# EAGLE design Standalone Kaleidoscope 8085 LED BOARD V1 (EAGLE 9.0.0)
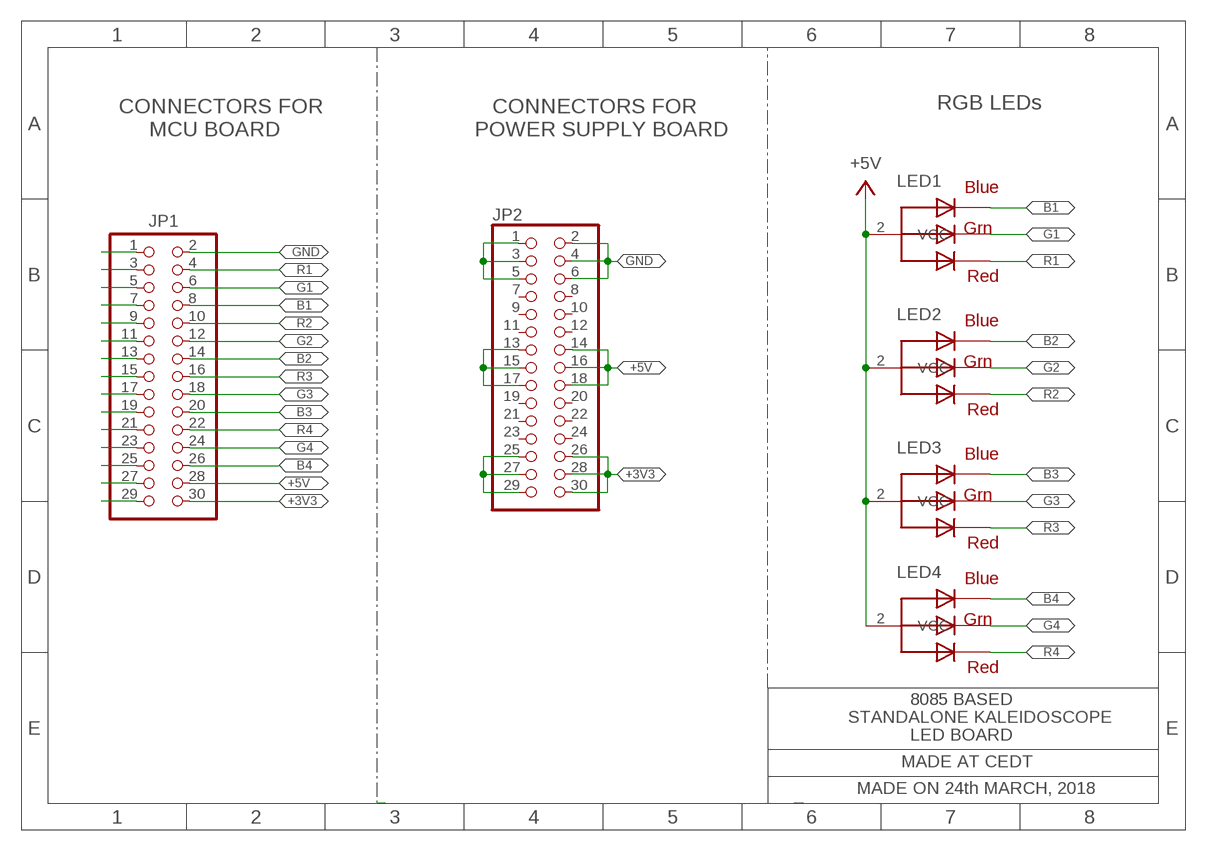
[diagram p0: schematic, sheet 1]

## Parts
JP1  PINHD-2X15  [2X15]
JP2  PINHD-2X15  [2X15]
LED1  RGBLED_CA  [LED5MMRGB]
LED2  RGBLED_CA  [LED5MMRGB]
LED3  RGBLED_CA  [LED5MMRGB]
LED4  RGBLED_CA  [LED5MMRGB]

## Nets
+3V3: JP1.29 JP1.30 JP2.25 JP2.26 JP2.27 JP2.28 JP2.29 JP2.30
+5V: JP1.27 JP1.28 JP2.13 JP2.14 JP2.15 JP2.16 JP2.17 JP2.18 LED1.2(VCC) LED2.2(VCC) LED3.2(VCC) LED4.2(VCC)
B1: JP1.7 JP1.8 LED1.4(BLUE)
B2: JP1.13 JP1.14 LED2.4(BLUE)
B3: JP1.19 JP1.20 LED3.4(BLUE)
B4: JP1.25 JP1.26 LED4.4(BLUE)
G1: JP1.5 JP1.6 LED1.3(GREEN)
G2: JP1.11 JP1.12 LED2.3(GREEN)
G3: JP1.17 JP1.18 LED3.3(GREEN)
G4: JP1.23 JP1.24 LED4.3(GREEN)
GND: JP1.1 JP1.2 JP2.1 JP2.2 JP2.3 JP2.4 JP2.5 JP2.6
R1: JP1.3 JP1.4 LED1.1(RED)
R2: JP1.9 JP1.10 LED2.1(RED)
R3: JP1.15 JP1.16 LED3.1(RED)
R4: JP1.21 JP1.22 LED4.1(RED)
Unconnected: JP2.7 JP2.8 JP2.9 JP2.10 JP2.11 JP2.12 JP2.19 JP2.20 JP2.21 JP2.22 JP2.23 JP2.24

## Notes on the sheet
- RGB LEDs
- CONNECTORS FOR
       MCU BOARD
- CONNECTORS FOR 
  POWER SUPPLY BOARD
- 8085 BASED
- STANDALONE KALEIDOSCOPE
- LED BOARD
- MADE AT CEDT
- MADE ON 24th MARCH, 2018

## Library data of the parts
JP1 JP2 = pinhead:PINHD-2X15: PIN HEADER
LED1-LED4 = 01_adafruit:RGBLED_CA: RGB LED, common-anode Staggered pins http://www.ladyada.net/library/pcb/eaglelibrary.html

## Net classes
1 VCC: width 0.61 mm
2 GND: width 0.61 mm

## Board
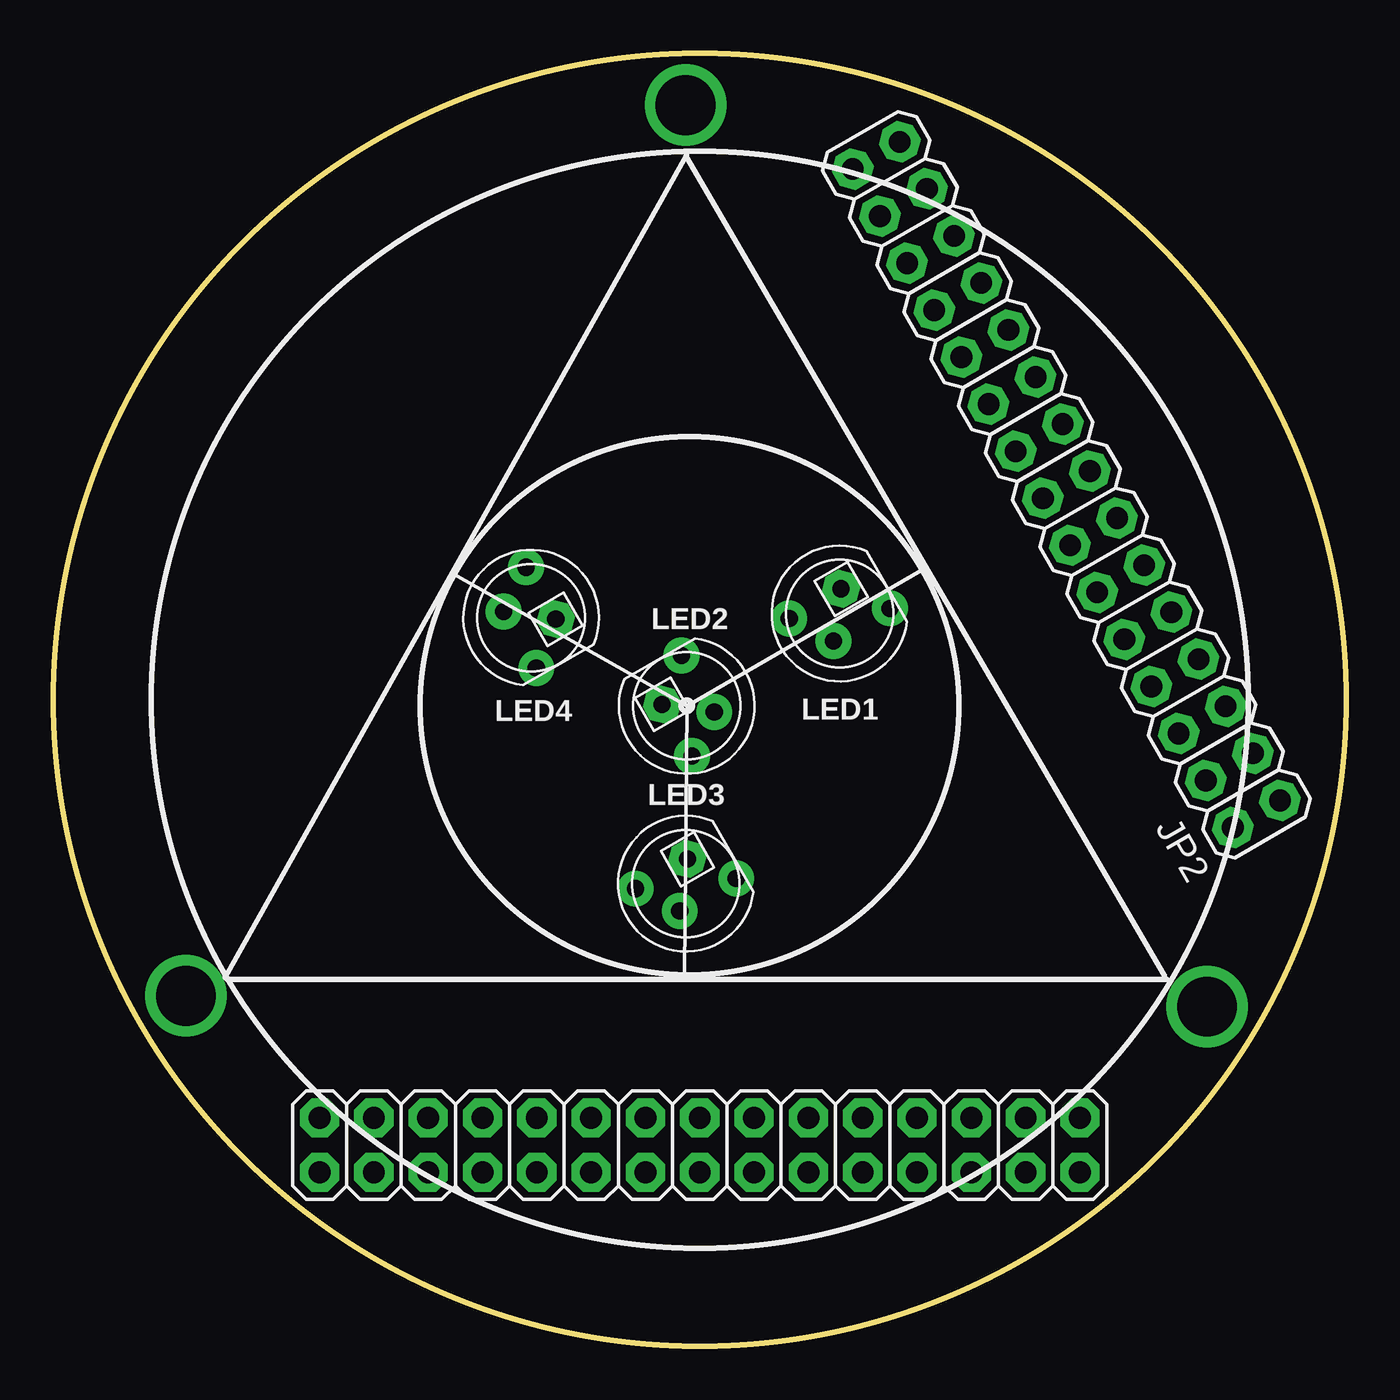
[diagram p1: board, top side]
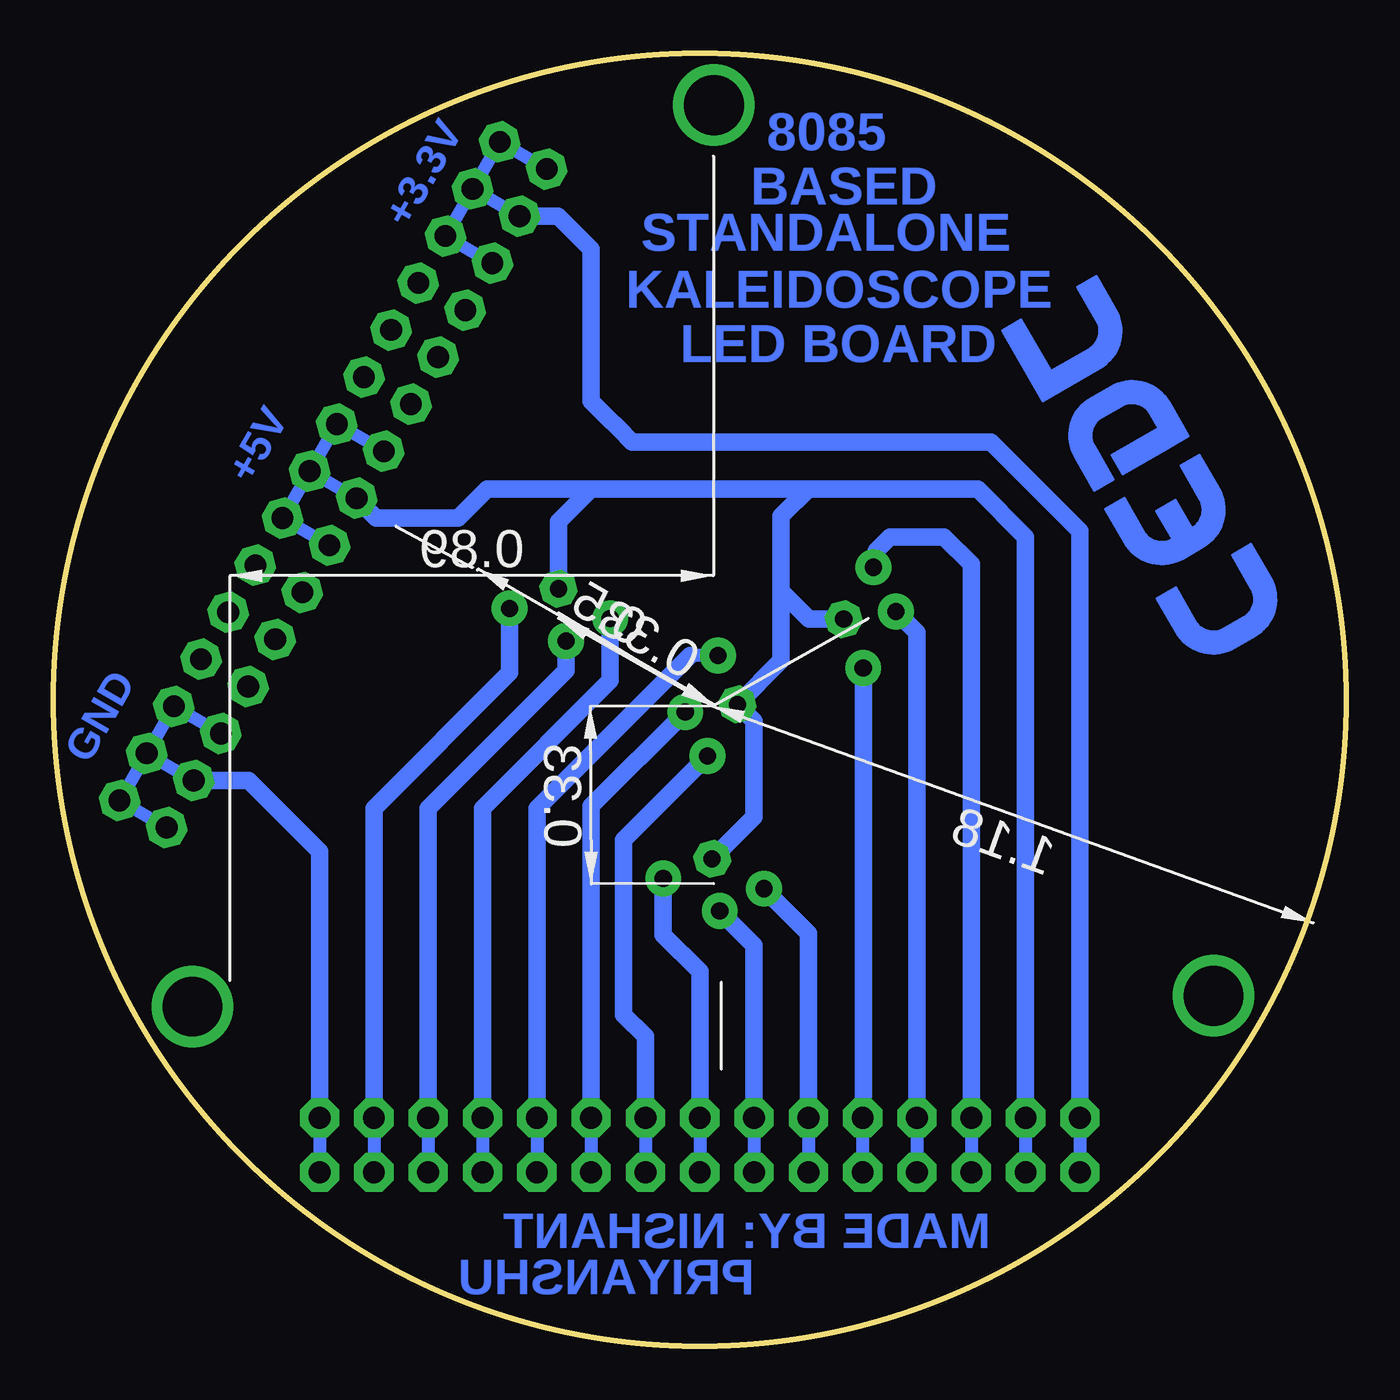
[diagram p2: board, bottom side, seen from below]

Size 60.45 x 60.45 mm. Coordinates in mm from the lower left corner, seen from the top.
Outline: circle at 30.23,30.23 radius 30.23
Copper layers (1*16): Top 0.035mm / dielectric 1.5mm / Bottom 0.035mm
Design rules "default *": minimum track width 10mil, minimum drill 24mil, track to track 14mil, track to pad 14mil, pad to pad 14mil, via to via 14mil, smd to smd 14mil, copper to edge 40mil, drill to drill 8mil, minimum pad ring 16mil, minimum via ring 16mil, stop-mask expansion 4mil, vias tented up to drill 0mil, thermal gap 10mil
vRestrict: area 64.2,11.9 to 64.8,13.4; area 64.2,15.5 to 64.8,17; area 62.3,11.7 to 64.1,17.3; 3 lines

### Footprints (pad centres in the part's own frame; a part is rotated, then mirrored left to right if it is on the bottom)
2X15 = drill 1.016 octagon: 1 -17.78,-1.27; 2 -17.78,1.27; 3 -15.24,-1.27; 4 -15.24,1.27; 5 -12.7,-1.27; 6 -12.7,1.27; 7 -10.16,-1.27; 8 -10.16,1.27; 9 -7.62,-1.27; 10 -7.62,1.27; 11 -5.08,-1.27; 12 -5.08,1.27; 13 -2.54,-1.27; 14 -2.54,1.27; 15 0,-1.27; 16 0,1.27; 17 2.54,-1.27; 18 2.54,1.27; 19 5.08,-1.27; 20 5.08,1.27; 21 7.62,-1.27; 22 7.62,1.27; 23 10.16,-1.27; 24 10.16,1.27; 25 12.7,-1.27; 26 12.7,1.27; 27 15.24,-1.27; 28 15.24,1.27; 29 17.78,-1.27; 30 17.78,1.27
LED5MMRGB = drill 0.8 pad 1.676: 1 -2.159,0.968; 3 0.889,0.968; 4 2.159,-0.968 | drill 0.8 pad 1.676 octagon: 2 -0.635,-0.968

### Placement (x,y rotation side)
JP1  30.23,9.4 180 top
JP2  47.37,40.28 120 top
LED1  36.77,34.26 210 top
LED2  29.62,29.94 300 top
LED3  29.58,21.63 210 top
LED4  22.34,34.06 120 top
U$1  [LOGO-CEDT-BOT-18MM]  11.68,50.04 240 top

### Tracks (layer width: path | path; a pad name or v marks a point on that pad's centre or on a via)
+3V3
  Bottom 0.61: JP1.29 JP1.30 | JP2.30 JP2.29 JP2.27 | JP2.27 JP2.28 | JP2.27 JP2.25 JP2.26
  Bottom 0.813: JP2.28 36.84,52.85 35.31,51.31 35.31,44.2 34.53,43.42 34.04,42.93 33.39,42.28 16.61,42.28 12.45,38.12 JP1.29
+5V
  Bottom 0.61: JP1.27 JP1.28 | JP2.18 JP2.17 JP2.15 | JP2.15 JP2.16 | JP2.15 JP2.13 JP2.14
  Bottom 0.813: LED3.2 27.69,24.74 27.69,29.23 LED2.2 26.42,32.05 26.42,35.31 | 25.15,40.09 17.23,40.09 14.99,37.85 JP1.27 | 25.15,40.09 35.31,40.09 | LED4.2 25.11,34 26.42,35.31 | 26.42,35.31 26.42,38.82 25.15,40.09 | LED1.2 36.83,38.56 35.31,40.09 | 35.31,40.09 39.47,40.09 40.17,40.09 41.54,38.73 45.35,38.73 JP2.16
B1
  Bottom 0.61: JP1.7 JP1.8
  Bottom 0.813: LED1.4 34.41,31.12 40.39,25.15 JP1.7
B2
  Bottom 0.61: JP1.13 JP1.14
  Bottom 0.813: LED2.4 33.78,23.67 33.78,15.49 32.77,14.48 JP1.13
B3
  Bottom 0.61: JP1.19 JP1.20
  Bottom 0.813: LED3.4 25.15,19.31 JP1.19
B4
  Bottom 0.61: 21.97,36.55 LED4.4 | JP1.25 JP1.26
  Bottom 0.813: 21.97,36.55 21.97,37.21 21.34,37.85 18.8,37.85 17.53,36.58 JP1.25
G1
  Bottom 0.61: JP1.5 JP1.6
  Bottom 0.813: LED1.3 36.48,31.59 42.93,25.15 JP1.5
G2
  Bottom 0.61: JP1.11 JP1.12
  Bottom 0.813: LED2.3 35.31,25.25 JP1.11
G3
  Bottom 0.61: JP1.17 JP1.18
  Bottom 0.813: LED3.3 27.69,18.74 JP1.17
G4
  Bottom 0.61: JP1.23 JP1.24
  Bottom 0.813: LED4.3 20.07,33.36 JP1.23
GND
  Bottom 0.61: JP1.1 JP1.2 | JP2.6 JP2.5 JP2.3 | JP2.3 JP2.4 | JP2.3 JP2.1 JP2.2
  Bottom 0.813: JP1.1 48.01,23.13 51.32,26.45 JP2.4
N$2  (via drill 2.79)
  other vias: 29.56,58.03
N$3  (via drill 2.79)
  other vias: 6.2,16.38
N$4  (via drill 2.79)
  other vias: 53.95,15.87
R1
  Bottom 0.61: JP1.3 JP1.4
  Bottom 0.813: LED1.1 39.12,31.49 45.47,25.15 JP1.3
R2
  Bottom 0.61: LED2.1 30.67,32.3 | 37.83,11.7 JP1.9 JP1.10
  Bottom 0.813: 30.67,32.3 37.83,25.13 37.83,11.7
R3
  Bottom 0.61: JP1.15 JP1.16
  Bottom 0.813: LED3.1 31.93,19.23 30.23,17.53 JP1.15
R4
  Bottom 0.61: 22.58,11.71 JP1.21 JP1.22
  Bottom 0.813: LED4.1 22.58,11.71

### Text on the board
Bottom: 8085 | +3.3V | BASED | STANDALONE / KALEIDOSCOPE | LED BOARD | +5V | GND | MADE BY: NISHANT | PRIYANSHU